# EAGLE design Llethrau (EAGLE 9.6.2)
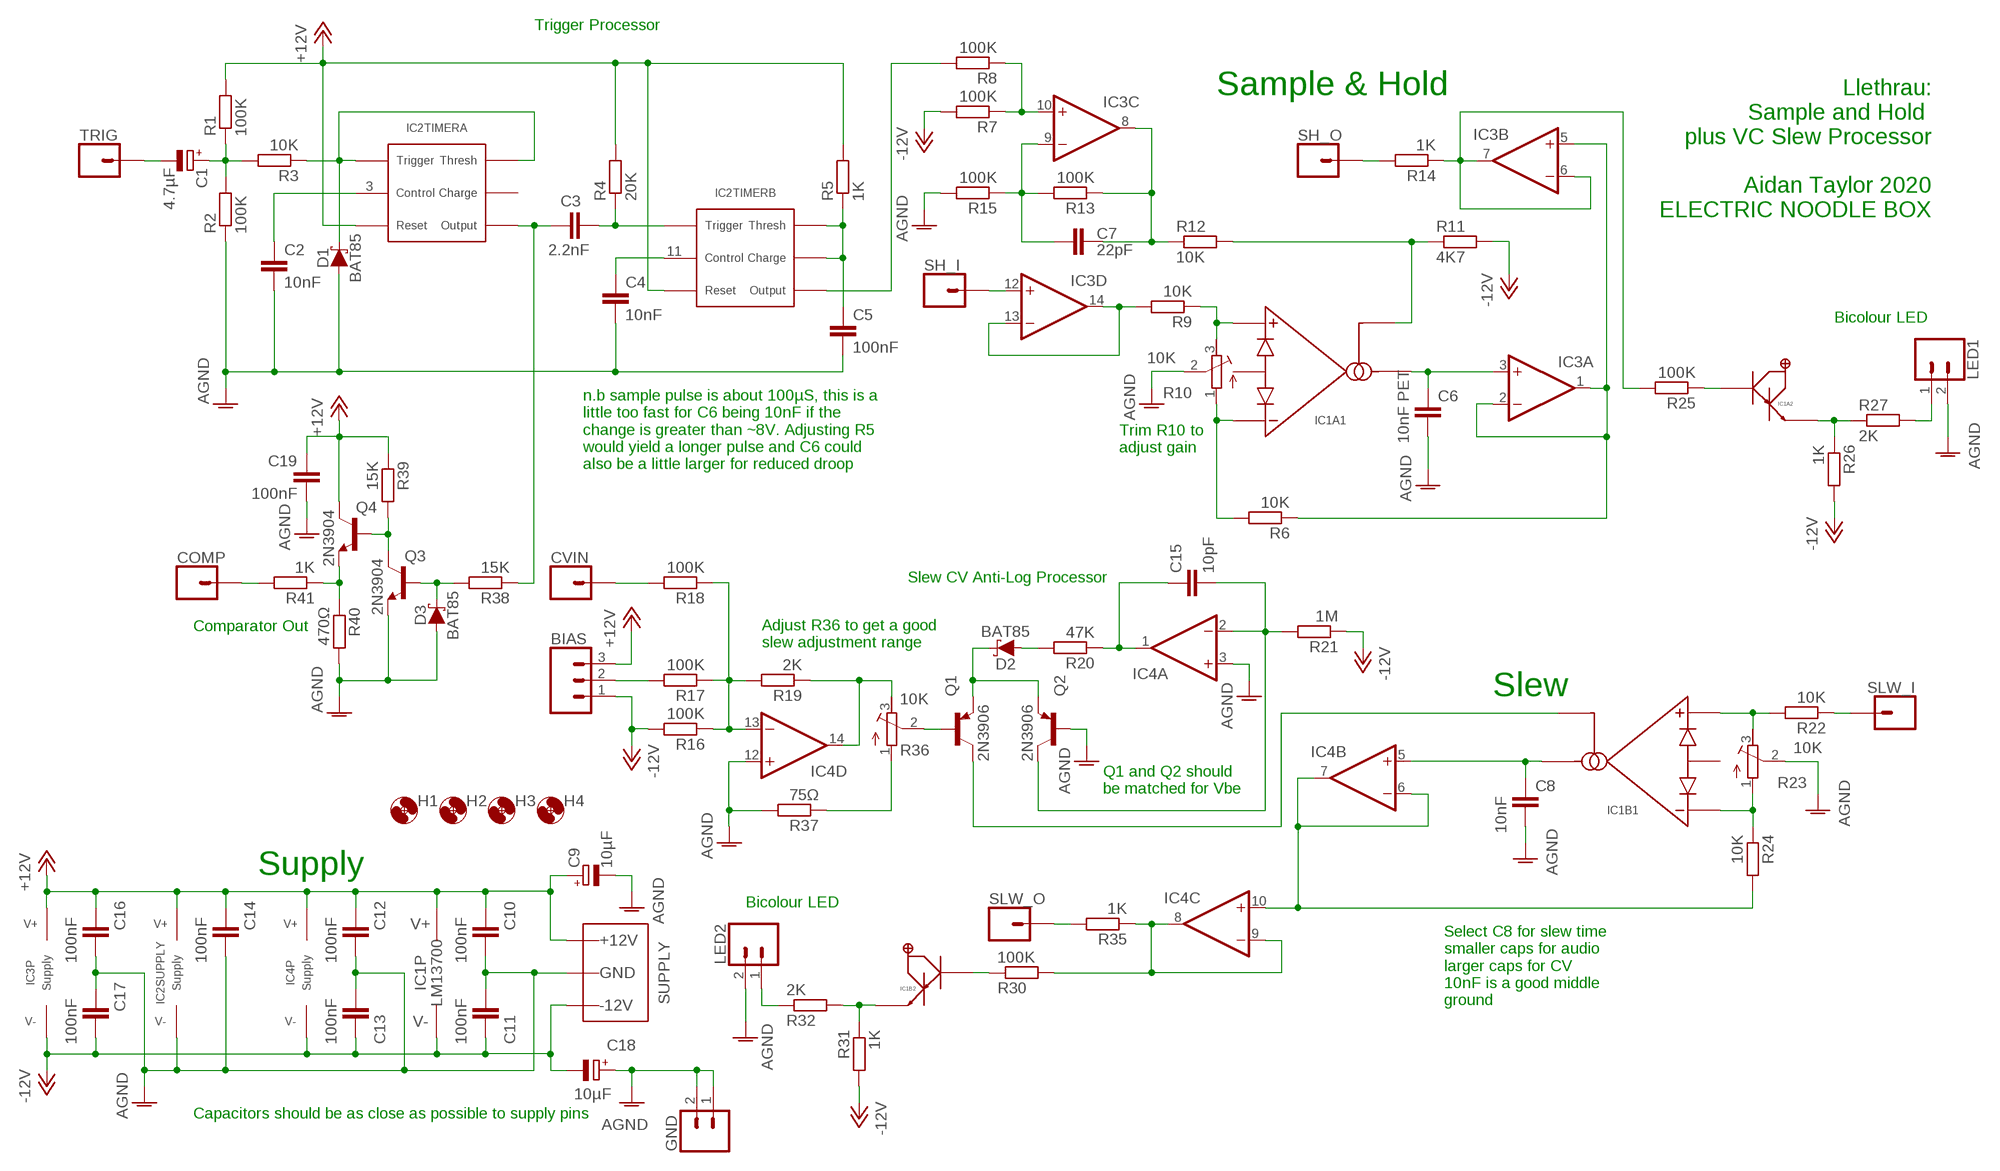
[diagram p0: schematic, sheet 1]

## Parts
BIAS  3XWIREPAD  [1X03]
C1  4.7µF  CPOL-EUE2.5-5  [E2,5-5]
C2  10nF  C-EU050-025X075  [C050-025X075]
C3  2.2nF  C-EU050-025X075  [C050-025X075]
C4  10nF  C-EU050-025X075  [C050-025X075]
C5  100nF  C-EU050-025X075  [C050-025X075]
C6  10nF PET  C-EU050-025X075  [C050-025X075]
C7  22pF  C-EU050-025X075  [C050-025X075]
C8  10nF  C-EU050-025X075  [C050-025X075]
C9  10µF  CPOL-EUE2.5-5  [E2,5-5]
C10  100nF  C-EU050-025X075  [C050-025X075]
C11  100nF  C-EU050-025X075  [C050-025X075]
C12  100nF  C-EU050-025X075  [C050-025X075]
C13  100nF  C-EU050-025X075  [C050-025X075]
C14  100nF  C-EU050-025X075  [C050-025X075]
C15  10pF  C-EU050-025X075  [C050-025X075]
C16  100nF  C-EU050-025X075  [C050-025X075]
C17  100nF  C-EU050-025X075  [C050-025X075]
C18  10µF  CPOL-EUE2.5-5  [E2,5-5]
C19  100nF  C-EU050-025X075  [C050-025X075]
COMP  1XWIREPAD  [1X01]
CVIN  1XWIREPAD  [1X01]
D1  BAT85  SCHOTTKY_DO35  [DO35-7]
D2  BAT85  SCHOTTKY_DO35  [DO35-7]
D3  BAT85  SCHOTTKY_DO35  [DO35-7]
GND  2XWIREPAD  [1X02]
H1  MOUNT-HOLE3.2  [3,2]
H2  MOUNT-HOLE3.2  [3,2]
H3  MOUNT-HOLE3.2  [3,2]
H4  MOUNT-HOLE3.2  [3,2]
IC1  LM13700DIL  [DIL16]
IC2  556_DUALTIMERDIL14  [DIL14]
IC3  TL0X4DIL  [DIL14]
IC4  TL0X4DIL  [DIL14]
LED1  2XWIREPAD  [1X02]
LED2  2XWIREPAD  [1X02]
Q1  2N3906  [TO92]
Q2  2N3906  [TO92]
Q3  2N3904  [TO92]
Q4  2N3904  [TO92]
R1  100K  R-EU_0207/7  [0207/7]
R2  100K  R-EU_0207/7  [0207/7]
R3  10K  R-EU_0207/7  [0207/7]
R4  20K  R-EU_0207/7  [0207/7]
R5  1K  R-EU_0207/7  [0207/7]
R6  10K  R-EU_0207/7  [0207/7]
R7  100K  R-EU_0207/7  [0207/7]
R8  100K  R-EU_0207/7  [0207/7]
R9  10K  R-EU_0207/7  [0207/7]
R10  10K  R-TRIMM3296W  [RTRIM3296W]
R11  4K7  R-EU_0207/7  [0207/7]
R12  10K  R-EU_0207/7  [0207/7]
R13  100K  R-EU_0207/7  [0207/7]
R14  1K  R-EU_0207/7  [0207/7]
R15  100K  R-EU_0207/7  [0207/7]
R16  100K  R-EU_0207/7  [0207/7]
R17  100K  R-EU_0207/7  [0207/7]
R18  100K  R-EU_0207/7  [0207/7]
R19  2K  R-EU_0207/7  [0207/7]
R20  47K  R-EU_0207/7  [0207/7]
R21  1M  R-EU_0207/7  [0207/7]
R22  10K  R-EU_0207/7  [0207/7]
R23  10K  R-TRIMM3296W  [RTRIM3296W]
R24  10K  R-EU_0207/7  [0207/7]
R25  100K  R-EU_0207/7  [0207/7]
R26  1K  R-EU_0207/7  [0207/7]
R27  2K  R-EU_0207/7  [0207/7]
R30  100K  R-EU_0207/7  [0207/7]
R31  1K  R-EU_0207/7  [0207/7]
R32  2K  R-EU_0207/7  [0207/7]
R35  1K  R-EU_0207/7  [0207/7]
R36  10K  R-TRIMM3296W  [RTRIM3296W]
R37  75Ω  R-EU_0207/7  [0207/7]
R38  15K  R-EU_0207/7  [0207/7]
R39  15K  R-EU_0207/7  [0207/7]
R40  470Ω  R-EU_0207/7  [0207/7]
R41  1K  R-EU_0207/7  [0207/7]
SH_I  1XWIREPAD  [1X01]
SH_O  1XWIREPAD  [1X01]
SLW_I  1XWIREPAD  [1X01]
SLW_O  1XWIREPAD  [1X01]
TRIG  1XWIREPAD  [1X01]
WP1  COMBO_SUPPLY_HEADER  [COMBINED_POWER]

## Nets
+12V: BIAS.3 C9.+ C10.1 C12.1 C14.1 C16.1 C19.1 IC1.11(P:V+) IC2.4(TIMERA:RESET) IC2.10(TIMERB:RESET) IC2.14(SUPPLY:V+) IC3.4(P:V+) IC4.4(P:V+) Q4.1(C) R1.2 R4.2 R5.2 R39.1 WP1.V+1(V++) WP1.V+2(V++) WP1.V+3(V++)
-12V: BIAS.1 C11.2 C13.2 C17.2 C18.- IC1.6(P:V-) IC3.11(P:V-) IC4.11(P:V-) R7.2 R11.2 R16.2 R21.1 R26.2 R31.2 WP1.V-1(V--) WP1.V-2(V--) WP1.V-3(V--)
AGND: C2.2 C4.2 C5.2 C6.2 C8.2 C9.- C10.2 C11.1 C12.2 C13.1 C14.2 C16.2 C17.1 C18.+ C19.2 D1.A D3.A GND.1 GND.2 IC2.7(SUPPLY:V-) IC4.3(A:+IN) IC4.12(D:+IN) LED1.2 LED2.2 Q2.2(B) Q3.3(E) R2.1 R10.2(S) R15.2 R23.2(S) R37.2 R40.2 WP1.GND1(AGND) WP1.GND2(AGND) WP1.GND3(AGND) WP1.GND4(AGND) WP1.GND5(AGND) WP1.GND6(AGND) WP1.GND7(AGND) WP1.GND8(AGND)
N$1: D1.C IC2.2(TIMERA:THRESHOLD) IC2.6(TIMERA:TRIGGER) R3.1
N$2: C1.+ R1.1 R2.2 R3.2
N$3: LED1.1 R27.2
N$4: C3.1 IC2.5(TIMERA:OUTPUT) R38.1
N$5: C5.1 IC2.12(TIMERB:THRESHOLD) IC2.13(TIMERB:DISCHARGE) R5.1
N$6: C2.1 IC2.3(TIMERA:CONT)
N$7: C3.2 IC2.8(TIMERB:TRIGGER) R4.1
N$8: C4.1 IC2.11(TIMERB:CONT)
N$9: IC2.9(TIMERB:OUTPUT) R8.2
N$10: IC3.10(C:+IN) R7.1 R8.1
N$11: C7.2 IC3.8(C:OUT) R12.1 R13.1
N$12: C6.1 IC1.5(A1:AMPOUT) IC3.3(A:+IN)
N$13: IC3.1(A:OUT) IC3.2(A:-IN) IC3.5(B:+IN) R6.1
N$14: IC1.1(A1:AMPBIAS) R11.1 R12.2
N$15: IC1.4(A1:AMP-) R6.2 R10.1(A)
N$16: IC1.3(A1:AMP+) R9.1 R10.3(E)
N$17: IC3.13(D:-IN) IC3.14(D:OUT) R9.2
N$18: C1.- TRIG.1
N$19: IC3.12(D:+IN) SH_I.1
N$20: IC3.6(B:-IN) IC3.7(B:OUT) R14.1 R25.2
N$21: R14.2 SH_O.1
N$22: D2.C Q1.3(E) Q2.3(E)
N$23: C7.1 IC3.9(C:-IN) R13.2 R15.1
N$24: IC4.13(D:-IN) R16.1 R17.1 R18.1 R19.2
N$25: IC4.14(D:OUT) R19.1 R36.3(E)
N$26: D2.A R20.2
N$27: IC4.6(B:-IN) IC4.7(B:OUT) IC4.10(C:+IN) R24.2
N$28: BIAS.2 R17.2
N$29: CVIN.1 R18.2
N$30: IC1.14(B1:AMP+) R22.2 R23.3(E)
N$31: R36.1(A) R37.1
N$32: Q1.2(B) R36.2(S)
N$33: IC1.13(B1:AMP-) R23.1(A) R24.1
N$34: COMP.1 R41.2
N$35: D3.C Q3.2(B) R38.2
N$36: C8.1 IC1.12(B1:AMPOUT) IC4.5(B:+IN)
N$37: IC1.16(B1:AMPBIAS) Q1.1(C)
N$38: IC4.8(C:OUT) IC4.9(C:-IN) R30.2 R35.1
N$39: IC1.7(A2:BUFF_IN) R25.1
N$40: IC1.8(A2:BUFF_OUT) R26.1 R27.1
N$41: LED2.1 R32.1
N$42: IC1.10(B2:BUFF_IN) R30.1
N$43: IC1.9(B2:BUFF_OUT) R31.1 R32.2
N$45: R35.2 SLW_O.1
N$46: C15.1 IC4.1(A:OUT) R20.1
N$47: C15.2 IC4.2(A:-IN) Q2.1(C) R21.2
N$48: R22.1 SLW_I.1
N$49: Q3.1(C) Q4.2(B) R39.2
N$50: Q4.3(E) R40.1 R41.1
Unconnected: IC1.2(A1:DIODES) IC1.15(B1:DIODES) IC2.1(TIMERA:DISCHARGE)

## Notes on the sheet
- Trigger Processor
- Llethrau:
  Sample and Hold 
  plus VC Slew Processor
  
  Aidan Taylor 2020
  ELECTRIC NOODLE BOX
- Sample & Hold
- Bicolour LED
- Trim R10 to 
  adjust gain
- n.b sample pulse is about 100µS, this is a 
  little too fast for C6 being 10nF if the 
  change is greater than ~8V. Adjusting R5
  would yield a longer pulse and C6 could 
  also be a little larger for reduced droop
- Slew CV Anti-Log Processor
- Comparator Out
- Adjust R36 to get a good
  slew adjustment range
- Slew
- Q1 and Q2 should
  be matched for Vbe
- Supply
- Bicolour LED
- Select C8 for slew time
  smaller caps for audio
  larger caps for CV
  10nF is a good middle
  ground
- Capacitors should be as close as possible to supply pins

## Library data of the parts
BIAS = ElectricNoodleBox:3XWIREPAD
C1 C9 C18 = rcl:CPOL-EU: POLARIZED CAPACITOR, European symbol; SPICEPREFIX: C
C2-C8 C10-C17 C19 = rcl:C-EU: CAPACITOR, European symbol; SPICEPREFIX: C
COMP CVIN SH_I SH_O SLW_I SLW_O TRIG = ElectricNoodleBox:1XWIREPAD
D1-D3 = ElectricNoodleBox:SCHOTTKY_DO35
GND LED1 LED2 = ElectricNoodleBox:2XWIREPAD
H1-H4 = holes:MOUNT-HOLE: MOUNTING HOLE with drill center marker
IC1 = ElectricNoodleBox:LM13700: Dual Transconductance Amplifier with Darlington Buffer; CATALOGUE: 3118206; RETAILER: Farnell
IC2 = ElectricNoodleBox:556_DUALTIMER
IC3 IC4 = ElectricNoodleBox:TL0X4: Quad Operational Amplifier; CATALOGUE: 3005140; RETAILER: Farnell
Q1 Q2 = transistor-pnp:2N3906: PNP Transistor
Q3 Q4 = transistor-npn:2N3904: NPN Transistor
R1-R9 R11-R22 R24-R27 R30-R32 R35 R37-R41 = rcl:R-EU_: RESISTOR, European symbol; SPICEPREFIX: R
R10 R23 R36 = rcl:R-TRIMM: Trimm resistor; SPICEMODEL: X; SPICEPREFIXL: POT
WP1 = ElectricNoodleBox:COMBO_SUPPLY_HEADER

## Board
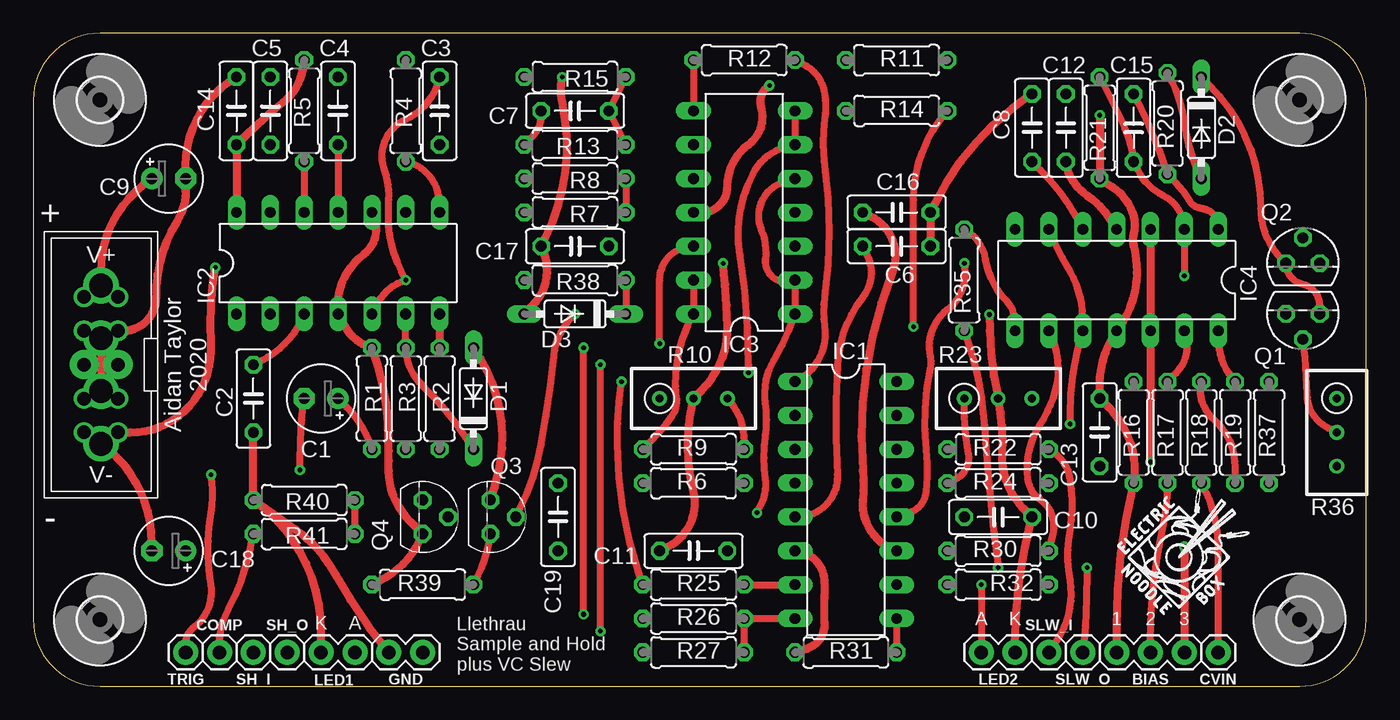
[diagram p1: board, top side]
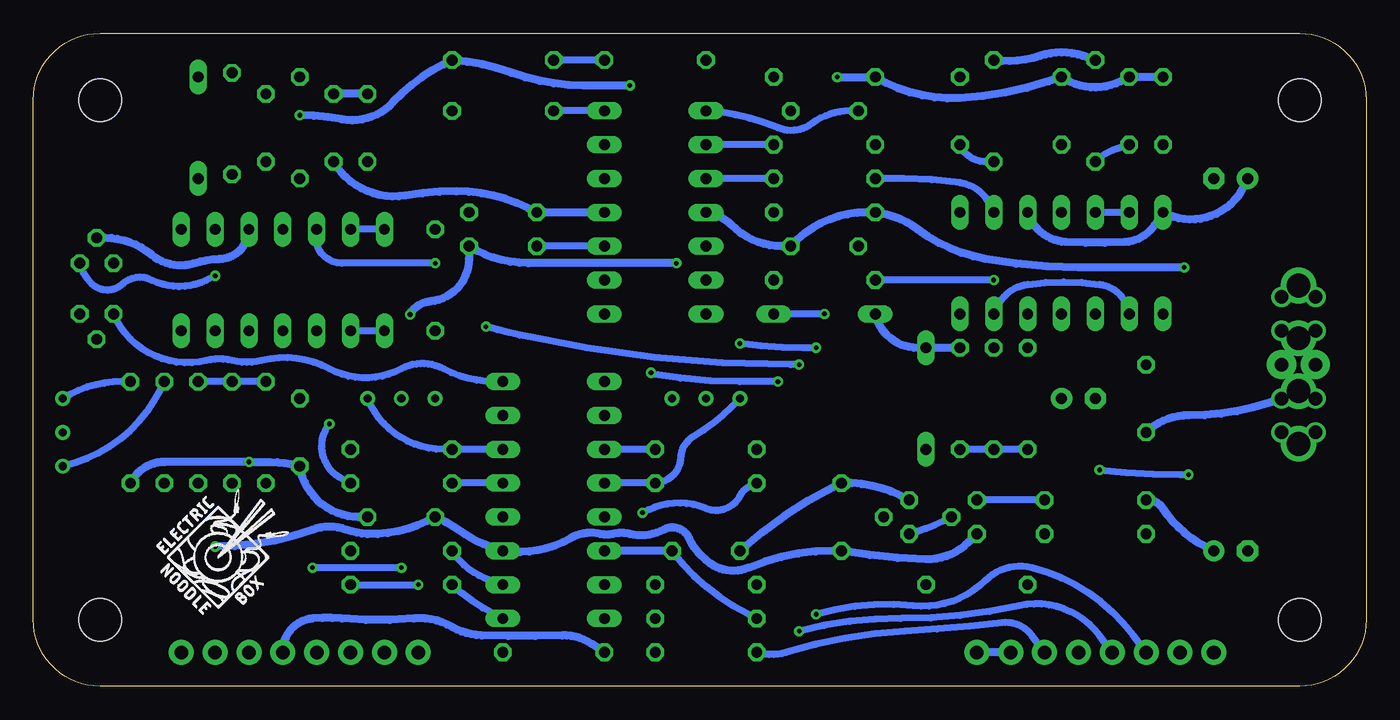
[diagram p2: board, bottom side, seen from below]

Size 100 x 49 mm. Coordinates in mm from the lower left corner, seen from the top.
Outline: 0,44 0,5 arc90 5,0 95,0 arc90 100,5 100,44 arc90 95,49 5,49 arc90 0,44
Copper layers (1*16): Top 0.035mm / dielectric 1.5mm / Bottom 0.035mm
Design rules "default": minimum track width 6mil, minimum drill 0.35mm, track to track 6mil, track to pad 6mil, pad to pad 6mil, via to via 6mil, smd to smd 6mil, copper to edge 40mil, drill to drill 6mil, minimum pad ring 10mil, minimum via ring 8mil, stop-mask expansion 4mil, vias tented up to drill 0mil, thermal gap 10mil

### Footprints (pad centres in the part's own frame; a part is rotated, then mirrored left to right if it is on the bottom)
1X03 = drill 1.016 pad 1.88: 1 0,0; 2 2.54,0; 3 5.08,0
E2,5-5 = drill 0.813 pad 1.6: + -1.27,0 | drill 0.813 pad 1.6 octagon: - 1.27,0
C050-025X075 = drill 0.813 octagon: 1 -2.54,0; 2 2.54,0
1X01 = drill 1.016 pad 1.88: 1 0,0
DO35-7 = drill 0.813 long: A 3.81,0; C -3.81,0
1X02 = drill 1.016 pad 1.88: 1 0,0; 2 2.54,0
3,2 = hole 3.2: 0,0
DIL16 = drill 0.813 long: 1 -8.89,-3.81; 2 -6.35,-3.81; 3 -3.81,-3.81; 4 -1.27,-3.81; 5 1.27,-3.81; 6 3.81,-3.81; 7 6.35,-3.81; 8 8.89,-3.81; 9 8.89,3.81; 10 6.35,3.81; 11 3.81,3.81; 12 1.27,3.81; 13 -1.27,3.81; 14 -3.81,3.81; 15 -6.35,3.81; 16 -8.89,3.81
DIL14 = drill 0.813 long: 1 -7.62,-3.81; 2 -5.08,-3.81; 3 -2.54,-3.81; 4 0,-3.81; 5 2.54,-3.81; 6 5.08,-3.81; 7 7.62,-3.81; 8 7.62,3.81; 9 5.08,3.81; 10 2.54,3.81; 11 0,3.81; 12 -2.54,3.81; 13 -5.08,3.81; 14 -7.62,3.81
TO92 = drill 0.813 octagon: 1 1.27,0; 2 0,1.905; 3 -1.27,0
0207/7 = drill 0.813 octagon: 1 -3.81,0; 2 3.81,0
RTRIM3296W = drill 0.61: 1 0,-2.54; 2 0,0; 3 0,2.54
COMBINED_POWER = drill 1.78: GND1 -1.98,0; GND2 1.98,0; V+1 -5.94,0; V-1 5.94,0 | drill 1.016: GND3 -2.54,1.27; GND5 2.54,1.27; GND6 -2.54,-1.27; GND8 2.54,-1.27; V+2 -5.08,1.27; V+3 -5.08,-1.27; V-2 5.08,1.27; V-3 5.08,-1.27 | drill 1.016 pad 2.184: GND4 0,1.27; GND7 0,-1.27

### Placement (x,y rotation side)
BIAS  81.28,2.54 0 top
C1  21.59,21.59 180 top
C2  16.51,21.59 270 top
C3  30.48,43.18 270 top
C4  22.86,43.18 90 top
C5  17.78,43.18 90 top
C6  64.77,33.02 0 top
C7  40.64,43.18 180 top
C8  74.93,41.91 90 top
C9  10.16,38.1 0 top
C10  72.39,12.7 0 top
C11  49.53,10.16 0 top
C12  77.47,41.91 90 top
C13  80.01,19.05 90 top
C14  15.24,43.18 90 top
C15  82.55,41.91 270 top
C16  64.77,35.56 0 top
C17  40.64,33.02 0 top
C18  10.16,10.16 180 top
C19  39.37,12.7 90 top
COMP  13.97,2.54 270 top
CVIN  88.9,2.54 90 top
D1  33.02,21.59 90 top
D2  87.63,41.91 270 top
D3  40.64,27.94 180 top
GND  26.67,2.54 0 top
H1  5,5 0 top
H2  5,44 0 top
H3  95,5 0 top
H4  95,44 0 top
IC1  60.96,13.97 270 top
IC2  22.86,31.75 0 top
IC3  53.34,35.56 90 top
IC4  81.28,30.48 180 top
LED1  24.13,2.54 180 top
LED2  71.12,2.54 0 top
Q1  95.25,27.94 180 top
Q2  95.25,31.75 0 top
Q3  34.29,12.7 270 top
Q4  29.21,12.7 270 top
R1  25.4,21.59 90 top
R2  30.48,21.59 270 top
R3  27.94,21.59 270 top
R4  27.94,43.18 90 top
R5  20.32,43.18 90 top
R6  49.53,15.24 0 top
R7  40.64,35.56 180 top
R8  40.64,38.1 180 top
R9  49.53,17.78 180 top
R10  49.53,21.59 270 top
R11  64.77,46.99 0 top
R12  53.34,46.99 0 top
R13  40.64,40.64 0 top
R14  64.77,43.18 0 top
R15  40.64,45.72 180 top
R16  82.55,19.05 270 top
R17  85.09,19.05 270 top
R18  87.63,19.05 270 top
R19  90.17,19.05 270 top
R20  85.09,42.23 90 top
R21  80.01,41.91 90 top
R22  72.39,17.78 180 top
R23  72.39,21.59 270 top
R24  72.39,15.24 0 top
R25  49.53,7.62 180 top
R26  49.53,5.08 180 top
R27  49.53,2.54 180 top
R30  72.39,10.16 0 top
R31  60.96,2.54 180 top
R32  72.39,7.62 180 top
R35  69.85,30.48 270 top
R36  97.79,19.05 180 top
R37  92.71,19.05 270 top
R38  40.64,30.48 0 top
R39  29.21,7.62 0 top
R40  20.32,13.97 180 top
R41  20.32,11.43 180 top
SH_I  16.51,2.54 90 top
SH_O  19.05,2.54 270 top
SLW_I  76.2,2.54 270 top
SLW_O  78.74,2.54 90 top
TRIG  11.43,2.54 90 top
U$1  [LOGO10X10]  81.28,5.08 0 top
U$2  [LOGO10X10]  90.81,5.08 0 bottom
WP1  5.08,24.13 270 top

### Tracks (layer width: path | path; a pad name or v marks a point on that pad's centre or on a via)
+12V  (via drill 0.35)
  Top 0.61: R39.1 26.04,7.94 arc42 Q4.1 28.26,12.38 arc-45 26.67,16.19 arc0 26.67,18.41 arc21 R1.2 arc-46 23.18,27.3 IC2.4 22.86,28.57 arc-53 24.77,32.38 arc84 IC2.10 | WP1.V+1 5.08,31.11 arc-57 C9.+ | IC2.14 C14.1 15.88,41.27 arc-7 18.73,43.81 arc50 R5.2 | IC4.4 80.64,35.24 arc23 79.06,36.83 arc-49 C12.1 | C16.1 62.87,35.24 arc-85 64.45,31.11 arc26 62.23,16.19 arc-9 62.23,13.97 arc76 IC1.11 | v86.36,10.48 BIAS.3 | WP1.V+1 WP1.V+3 | WP1.V+1 WP1.V+2
  Bottom 0.61: Q4.1 29.84,10.79 arc46 33.02,9.53 arc9 C19.1 40.01,10.16 arc-23 46.35,8.89 arc58 49.21,9.21 arc30 50.8,11.11 arc-93 52.7,11.75 arc42 55.24,11.43 arc-28 56.52,11.43 arc28 57.47,11.43 arc-44 59.69,11.11 arc39 IC1.11 65.72,10.48 arc16 67.63,11.43 arc-10 C10.1 70.48,12.38 arc29 74.93,11.43 arc18 76.52,11.75 arc-40 79.06,11.75 arc21 v86.36,10.48 | C9.+ 9.21,37.47 arc92 IC2.14 15.88,34.61 arc53 18.1,33.34 arc6 22.54,33.34 arc69 IC2.10 | R5.2 21.27,47.31 arc-37 24.45,47.31 arc26 R4.2 | IC3.4 C16.1 62.87,35.88 arc-27 68.26,37.15 arc-9 72.07,36.83 arc69 C12.1
-12V  (via drill 0.35)
  Top 0.61: WP1.V-1 arc-55 8.89,10.79 C18.- | R31.2 58.1,2.86 arc76 59.37,4.76 arc-8 59.37,6.67 arc8 59.37,7.94 arc82 IC1.6 | v13.65,31.43 arc13 13.34,25.72 arc-34 12.38,21.91 arc-59 7.3,19.05 WP1.V-2 WP1.V-1 | IC3.11 50.16,35.56 arc90 52.07,37.47 arc-53 53.66,40.64 arc69 54.61,43.5 arc-76 v55.24,45.09 | v80.01,42.86 R21.1 80.96,37.47 arc-42 82.55,35.24 arc-30 82.55,33.97 arc30 82.55,33.02 arc-52 IC4.11 arc34 80.01,22.54 C13.2 80.64,20.95 arc-53 R16.2 arc13 81.28,4.45 BIAS.1 | WP1.V-3 WP1.V-1
  Bottom 0.508: R26.2 46.35,5.4 arc26 C11.2
  Bottom 0.61: C11.2 IC1.6 | v13.65,31.43 21.59,31.43 arc10 28.57,32.07 arc26 33.66,34.29 arc-30 R7.2 37.47,35.56 arc-48 C17.2 43.81,33.02 arc45 47.62,34.61 arc-37 IC3.11 | v55.24,45.09 58.74,45.09 arc20 64.14,46.04 arc-16 R11.2 69.22,46.67 arc-21 73.03,43.81 arc57 76.83,42.55 arc-9 v80.01,42.86 | R31.2 58.1,3.17 arc-35 60.33,3.81 arc4 66.36,3.81 arc28 68.58,4.45 arc-35 71.44,5.08 arc10 76.83,5.08 arc-10 79.06,5.08 arc-88 BIAS.1
AGND  (via drill 0.35)
  Top 0.61: LED1.2 21.59,4.13 arc55 R40.2 | C11.1 47.62,10.48 arc77 49.53,14.61 arc-28 R10.2 50.16,22.23 arc46 52.07,26.99 arc5 v51.75,31.75 | R40.2 C2.2 | IC2.7 R2.1 | D3.A 37.47,28.57 arc74 C17.1 38.42,33.66 arc39 39.69,43.81 arc-25 v39.69,45.72 | C14.2 arc59 11.43,39.05 C9.- 11.43,37.15 arc-32 10.79,34.92 arc33 9.21,29.21 arc-98 WP1.GND3 WP1.GND1 | C6.2 C16.2 67.63,36.2 arc-30 C8.2 | LED2.2 73.66,3.17 arc-15 C10.2 74.3,13.34 arc-48 72.71,17.46 arc15 R23.2 arc-12 71.75,26.67 v71.73,27.89 | IC4.3 IC4.12 v83.82,16.83 | Q3.3 34.61,14.92 arc54 D1.A | WP1.GND4 WP1.GND2 | WP1.GND2 WP1.GND5 | WP1.GND2 WP1.GND8 | WP1.GND7 WP1.GND2 | WP1.GND7 WP1.GND4 | WP1.GND7 WP1.GND1 | WP1.GND1 WP1.GND4 | WP1.GND6 WP1.GND1 | WP1.GND1 WP1.GND2 | R40.2 19.68,11.75 arc-26 22.54,8.57 arc11 GND.1
  Bottom 0.61: R40.2 arc62 15.24,13.34 arc-31 12.06,10.48 C18.+ | Q3.3 34.92,14.29 arc-29 C19.2 40.01,14.92 arc-15 C11.1 | WP1.GND5 7.3,21.27 arc19 13.34,20.32 arc-45 C2.2 | R2.1 D1.A 33.66,25.4 arc77 D3.A | v39.69,45.72 R15.2 arc-34 30.48,44.13 arc-15 23.81,45.4 C4.2 arc-61 18.41,45.4 C5.2 C14.2 | C8.2 C12.2 | v51.75,31.75 62.87,31.75 arc32 C6.2 67.31,32.07 arc84 70.17,28.89 arc-50 71.75,27.94 arc-130 v71.73,27.89 | C10.2 75.56,12.7 arc81 C13.1 arc-16 82.23,16.83 v83.82,16.83 90.17,16.83 arc-64 R37.2 | Q2.2 94.61,33.66 arc40 91.12,32.38 arc-57 87.95,31.75 arc16 86.04,32.07 arc-87 IC4.3 | GND.1 GND.2
N$1
  Top 0.508: D1.C 32.38,18.73 arc12 29.21,22.54 arc-44 R3.1 IC2.6
  Bottom 0.508: IC2.6 27.62,28.57 arc56 25.4,30.16 arc15 20,30.16 arc75 IC2.2
N$2
  Top 0.508: C1.+ 23.5,20.95 arc-28 R1.1
  Bottom 0.508: R1.1 R3.2 R2.2
N$3
  Bottom 0.508: LED1.1 25.08,3.81 arc-60 27.3,4.76 arc4 34.61,4.13 arc-14 43.5,2.54 arc34 R27.2
N$4  (via drill 0.35)
  Top 0.508: IC2.5 25.72,28.57 arc-46 v27.94,30.48 27.62,31.11 arc-23 26.67,34.61 arc-8 26.67,36.51 arc24 26.35,38.73 arc-86 27.94,42.55 arc54 C3.1
  Bottom 0.508: v27.94,30.48 R38.1
N$5
  Top 0.508: R5.1 IC2.12
  Bottom 0.508: C5.1 18.73,40.32 arc-25 R5.1 | IC2.13 IC2.12
N$6
  Top 0.508: C2.1 17.14,24.45 arc42 IC2.3
N$7
  Top 0.508: IC2.8 30.48,36.2 arc77 R4.1
  Bottom 0.508: R4.1 28.57,39.37 arc67 C3.2
N$8
  Top 0.508: C4.1 IC2.11
N$9
  Bottom 0.508: IC2.9 28.26,36.2 arc-56 30.48,37.78 arc-10 R8.2
N$10
  Top 0.508: R8.1 R7.1
  Bottom 0.508: R8.1 IC3.10
N$11
  Top 0.508: R13.1 37.47,41.27 arc53 C7.2 | R12.1 IC3.8
  Bottom 0.508: C7.2 38.73,43.18 arc-37 41.59,42.23 arc59 44.13,41.91 arc-19 IC3.8
N$12
  Top 0.508: C6.1 62.55,32.38 arc-65 62.23,29.21 arc35 60.33,24.13 arc6 60.33,15.88 arc-96 IC1.5
  Bottom 0.508: IC3.3 C6.1
N$13  (via drill 0.35)
  Top 0.508: IC3.5 56.2,37.78 arc94 54.61,34.29 arc-29 54.93,32.07 arc122 IC3.2 IC3.1 arc-12 55.56,24.45 arc38 54.93,21.27 arc-15 54.93,18.73 arc15 54.93,15.56 arc-34 54.61,13.65 v54.29,13.02
  Bottom 0.508: R6.1 46.35,14.92 arc-37 46.99,14.29 arc86 49.53,13.34 arc-52 v54.29,13.02
N$14
  Top 0.508: R12.2 57.78,46.67 arc-56 59.37,44.45 arc-15 59.37,42.55 arc15 59.37,39.05 arc-15 59.37,29.21 arc15 59.37,26.99 arc-72 IC1.1
  Bottom 0.508: R12.2 R11.1
N$15
  Bottom 0.508: IC1.4 R6.2 arc-85 51.44,17.14 arc57 50.48,18.73 arc-14 47.62,20.95 R10.1
N$16
  Top 0.508: R9.1 53.34,18.41 arc44 R10.3
  Bottom 0.508: R9.1 IC1.3
N$17
  Top 0.508: R9.2 46.35,18.41 arc10 47.94,20.32 arc41 48.26,21.59 arc-36 IC3.14 IC3.13
N$18  (via drill 0.35)
  Top 0.508: TRIG.1 11.43,3.17 arc-53 12.06,4.45 arc63 13.34,7.62 arc-19 13.34,13.02 arc19 v13.34,15.88 | v20,16.23 20,16.83 arc-7 C1.-
  Bottom 0.508: v13.34,15.88 13.97,15.88 arc6 20,16.19 arc174 v20,16.23
N$19  (via drill 0.35)
  Top 0.508: v41.27,5.4 v41.27,25.4 | IC3.12 arc90 46.99,30.48 v46.99,25.72
  Bottom 0.508: v41.27,25.4 42.23,25.4 arc8 v46.99,25.72 | SH_I.1 17.46,3.81 arc-39 25.08,8.89 arc-59 28.57,7.94 arc51 33.97,6.03 arc-22 v41.27,5.4
N$20  (via drill 0.35)
  Top 0.508: R25.2 45.4,8.57 arc-18 43.81,18.1 arc-9 v44.13,22.86 | IC3.7 IC3.6 arc56 53.98,38.42 arc36 53.02,32.38 arc-9 53.66,24.13 v53.66,23.52
  Bottom 0.508: v53.66,23.52 53.66,23.44 arc-10 46.99,22.86 v44.13,22.86 | IC3.7 R14.1
N$21  (via drill 0.35)
  Top 0.508: v42.55,4.13 v42.55,24.13 | v66.04,26.99 66.04,36.51 arc-42 R14.2
  Bottom 0.508: v42.55,24.13 43.18,24.13 arc12 63.5,26.35 arc3 v66.04,26.99 | SH_O.1 20,3.81 arc-66 26.04,6.03 arc13 34.92,5.08 arc-15 v42.55,4.13
N$22
  Top 0.508: Q1.3 96.52,28.57 arc77 95.25,30.16 arc-77 Q2.3 arc-50 92.08,35.88 arc45 88.27,45.09 D2.C
N$23
  Top 0.508: R13.2 C7.1 R15.1
  Bottom 0.508: R13.2 IC3.9
N$24
  Top 0.508: R19.2 90.17,16.51 arc49 88.58,20 arc-61 R18.1 | R17.1 85.72,23.5 arc67 IC4.13
  Bottom 0.508: R16.1 R17.1 R18.1
N$25
  Top 0.508: IC4.14 88.9,26.04 arc44 R19.1
  Bottom 0.508: R19.1 90.49,22.23 arc51 R36.3
N$26
  Top 0.508: R20.2 85.41,45.4 arc-20 86.36,42.23 arc21 D2.A
N$27  (via drill 0.35)
  Top 0.508: IC4.6 arc8 77.79,31.11 arc-31 78.74,27.62 IC4.10 arc17 77.79,20.32 v77.79,19.68
  Bottom 0.508: IC4.7 IC4.6 | R24.2 76.83,15.56 arc101 v77.79,19.68
N$28
  Top 0.508: BIAS.2 83.82,3.49 arc-13 84.77,12.06 arc14 R17.2
N$29
  Top 0.508: CVIN.1 88.9,10.48 arc30 R18.2
N$30
  Bottom 0.508: IC1.14 R22.2 69.22,17.78 arc67 R23.3
N$31
  Bottom 0.508: R37.1 93.34,22.86 arc-32 R36.1
N$32
  Top 0.508: R36.2 97.16,19.37 arc-63 95.57,21.91 arc8 Q1.2
N$33
  Top 0.508: R24.1 69.22,15.56 arc74 70.17,17.46 arc-12 R23.1
  Bottom 0.508: IC1.13 R24.1
N$34
  Top 0.508: COMP.1 13.97,3.17 arc-28 14.61,5.71 arc19 R41.2
N$35  (via drill 0.35)
  Top 0.508: R38.2 D3.C | Q3.2 36.51,13.34 arc16 38.1,18.1 arc4 39.05,24.77 arc-41 v40.64,27.94
  Bottom 0.508: v40.64,27.94 D3.C
N$36  (via drill 0.35)
  Top 0.508: IC1.12 65.72,13.02 arc66 66.99,14.61 arc12 66.99,17.78 arc-18 67.31,23.81 arc24 67.31,24.77 arc-64 68.58,28.26 arc64 v69.85,31.75 | C8.1 75.56,38.73 arc-19 IC4.5
  Bottom 0.508: IC4.5 arc-106 76.83,31.75 v69.85,31.75
N$37
  Bottom 0.508: IC1.16 65.41,22.86 arc28 69.22,23.81 arc-56 72.39,23.81 arc56 77.79,23.81 arc-42 82.87,24.45 arc28 85.09,24.45 arc-28 87,24.45 arc81 Q1.1
N$38
  Top 0.508: IC4.8 73.66,27.3 arc44 73.03,28.89 arc-34 71.44,32.07 arc52 R35.1 | R30.2 76.52,11.43 arc69 75.56,13.97 arc-48 74.61,15.56 arc-40 75.56,19.68 arc12 76.52,21.59 arc48 IC4.9
  Bottom 0.508: IC4.8 IC4.9
N$39
  Top 0.508: R25.1 IC1.7
N$40
  Top 0.508: R27.1 R26.1 IC1.8
N$41  (via drill 0.35)
  Top 0.508: v71.12,7.62 LED2.1
  Bottom 0.508: R32.1 v71.12,7.62
N$42
  Bottom 0.508: IC1.10 65.72,7.94 arc39 R30.1
N$43
  Top 0.508: IC1.9 R31.1
  Bottom 0.508: IC1.9 65.41,5.4 arc17 R32.2
N$45  (via drill 0.35)
  Top 0.508: R35.2 70.17,25.72 arc-11 71.12,21.59 arc-4 71.44,18.41 arc4 v72.39,8.89 | v79.06,8.89 79.06,8.57 arc-6 SLW_O.1
  Bottom 0.508: v72.39,8.89 v79.06,8.89
N$46
  Top 0.508: C15.1 82.87,43.81 arc-8 R20.1 85.72,37.78 arc-16 86.68,36.51 arc55 87.63,35.88 arc-90 IC4.1
N$47  (via drill 0.35)
  Top 0.508: R21.2 81.6,42.55 arc-20 C15.2 82.87,38.73 arc37 84.77,36.83 arc-63 IC4.2 v86.36,30.8
  Bottom 0.508: v86.36,30.8 87,30.48 arc53 91.12,30.48 arc-69 93.34,30.16 arc86 95.57,30.16 arc32 Q2.1
N$48
  Top 0.508: SLW_I.1 76.83,3.49 arc43 77.79,7.94 arc-19 77.79,11.75 arc19 77.79,15.56 arc52 R22.1
N$49
  Top 0.508: R39.2 33.34,8.26 arc20 Q3.1
  Bottom 0.508: Q4.2 31.75,12.38 arc12 Q3.1
N$50
  Top 0.508: R41.1 R40.1
  Bottom 0.508: R40.1 Q4.3

### Text on the board
tPlace: + | Aidan Taylor / 2020 | - | K | A | A | K | 1 | 2 | 3 | Llethrau / Sample and Hold / plus VC Slew